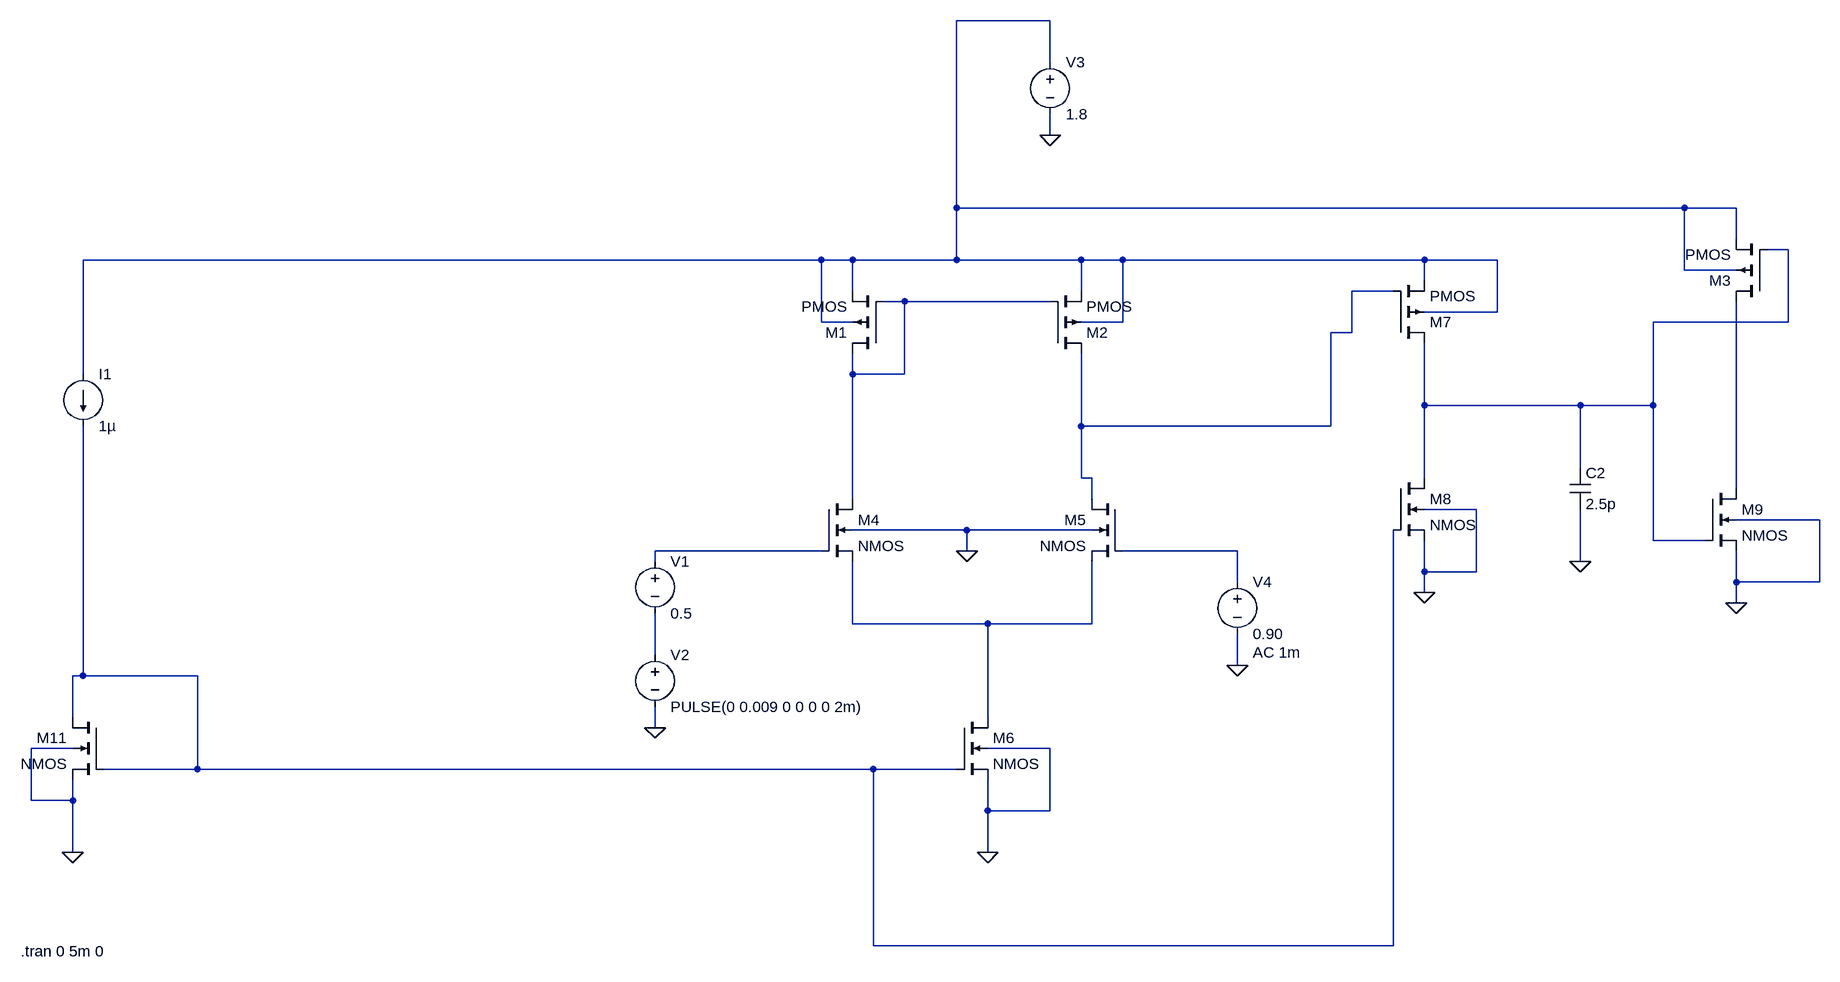
[diagram p0: schematic nmos_input_comparator.asc]
nmos_input_comparator.asc, the LTspice schematic file:
Version 4
SHEET 1 2396 680
WIRE 1088 -768 944 -768
WIRE 1088 -704 1088 -768
WIRE 1088 -592 1088 -624
WIRE 944 -480 944 -768
WIRE 2064 -480 944 -480
WIRE 2144 -480 2064 -480
WIRE 2144 -432 2144 -480
WIRE 2224 -416 2192 -416
WIRE 496 -400 -400 -400
WIRE 736 -400 496 -400
WIRE 784 -400 736 -400
WIRE 944 -400 944 -480
WIRE 944 -400 784 -400
WIRE 1136 -400 944 -400
WIRE 1200 -400 1136 -400
WIRE 1360 -400 1200 -400
WIRE 1664 -400 1360 -400
WIRE 1776 -400 1664 -400
WIRE 2064 -384 2064 -480
WIRE 2144 -384 2064 -384
WIRE 1664 -368 1664 -400
WIRE 784 -352 784 -400
WIRE 1136 -352 1136 -400
WIRE 1616 -352 1552 -352
WIRE 864 -336 832 -336
WIRE 1024 -336 864 -336
WIRE 1088 -336 1024 -336
WIRE 1776 -320 1776 -400
WIRE 1776 -320 1664 -320
WIRE 736 -304 736 -400
WIRE 784 -304 736 -304
WIRE 1200 -304 1200 -400
WIRE 1200 -304 1136 -304
WIRE 2224 -304 2224 -416
WIRE 2224 -304 2016 -304
WIRE 1552 -288 1552 -352
WIRE 1552 -288 1520 -288
WIRE -400 -224 -400 -400
WIRE 784 -224 784 -256
WIRE 864 -224 864 -336
WIRE 864 -224 784 -224
WIRE 2016 -224 2016 -304
WIRE 1664 -208 1664 -272
WIRE 2144 -208 2144 -336
WIRE 1136 -192 1136 -256
WIRE 1664 -176 1664 -208
WIRE 1904 -176 1664 -176
WIRE 2016 -176 2016 -224
WIRE 2016 -176 1904 -176
WIRE 1136 -144 1136 -192
WIRE 1520 -144 1520 -288
WIRE 1520 -144 1136 -144
WIRE 784 -96 784 -224
WIRE 1904 -80 1904 -176
WIRE 1136 -64 1136 -144
WIRE 1152 -64 1136 -64
WIRE 1664 -64 1664 -176
WIRE 2144 -48 2144 -208
WIRE 784 -32 784 -96
WIRE 1152 -32 1152 -64
WIRE 1744 -16 1664 -16
WIRE 2272 0 2144 0
WIRE 960 16 784 16
WIRE 1152 16 960 16
WIRE 2016 32 2016 -176
WIRE 2096 32 2016 32
WIRE 736 48 480 48
WIRE 960 48 960 16
WIRE 1376 48 1200 48
WIRE 480 64 480 48
WIRE 1904 64 1904 -16
WIRE 1664 80 1664 32
WIRE 1744 80 1744 -16
WIRE 1744 80 1664 80
WIRE 1376 96 1376 48
WIRE 2144 96 2144 48
WIRE 2272 96 2272 0
WIRE 2272 96 2144 96
WIRE 1664 112 1664 80
WIRE 2144 128 2144 96
WIRE 784 160 784 64
WIRE 880 160 784 160
WIRE 992 160 880 160
WIRE 1152 160 1152 64
WIRE 1152 160 992 160
WIRE 480 208 480 144
WIRE 1376 224 1376 176
WIRE 1616 224 1616 16
WIRE -400 240 -400 -144
WIRE -400 240 -416 240
WIRE -224 240 -400 240
WIRE -416 304 -416 240
WIRE 992 304 992 160
WIRE 480 320 480 288
WIRE -416 352 -480 352
WIRE 1088 352 992 352
WIRE -224 384 -224 240
WIRE -224 384 -368 384
WIRE 816 384 -224 384
WIRE 944 384 816 384
WIRE -480 432 -480 352
WIRE -416 432 -416 400
WIRE -416 432 -480 432
WIRE 992 448 992 400
WIRE 1088 448 1088 352
WIRE 1088 448 992 448
WIRE -416 512 -416 432
WIRE 992 512 992 448
WIRE 816 656 816 384
WIRE 1616 656 1616 224
WIRE 1616 656 816 656
FLAG 1088 -592 0
FLAG 960 48 0
FLAG 992 512 0
FLAG 1664 112 0
FLAG 1904 64 0
FLAG 2144 128 0
FLAG -416 512 0
FLAG 1376 224 0
FLAG 480 320 0
DATAFLAG 496 -400 ""
DATAFLAG 1360 -400 ""
DATAFLAG 784 -96 ""
DATAFLAG 1136 -192 ""
DATAFLAG 1664 -208 ""
DATAFLAG 2016 -224 ""
DATAFLAG 2144 -208 ""
DATAFLAG 1616 224 ""
DATAFLAG 880 160 ""
DATAFLAG 1024 -336 ""
SYMBOL nmos4 736 -32 R0
SYMATTR InstName M4
SYMATTR Value2 l=1u w=20u
SYMBOL nmos4 1200 -32 M0
SYMATTR InstName M5
SYMATTR Value2 l=1u w=20u
SYMBOL nmos4 944 304 R0
SYMATTR InstName M6
SYMATTR Value2 l=2u w=20u
SYMBOL voltage 1088 -720 R0
WINDOW 123 0 0 Left 2
WINDOW 39 0 0 Left 2
SYMATTR InstName V3
SYMATTR Value 1.8
SYMBOL nmos4 1616 -64 R0
SYMATTR InstName M8
SYMATTR Value2 l=2u w=20u
SYMBOL cap 1888 -80 R0
SYMATTR InstName C2
SYMATTR Value 2.5p
SYMBOL nmos4 2096 -48 R0
SYMATTR InstName M9
SYMATTR Value2 l=1u w=20u
SYMBOL nmos4 -368 304 M0
SYMATTR InstName M11
SYMATTR Value2 l=2u w=20u
SYMBOL current -400 -224 R0
WINDOW 123 0 0 Left 2
WINDOW 39 0 0 Left 2
SYMATTR InstName I1
SYMATTR Value 1µ
SYMBOL voltage 1376 80 R0
WINDOW 123 24 124 Left 2
WINDOW 39 0 0 Left 2
SYMATTR Value2 AC 1m
SYMATTR InstName V4
SYMATTR Value 0.90
SYMBOL voltage 480 48 R0
WINDOW 123 24 124 Left 2
WINDOW 39 0 0 Left 2
SYMATTR InstName V1
SYMATTR Value 0.5
SYMBOL pmos4 832 -256 R180
SYMATTR InstName M1
SYMATTR Value2 l=5u w=20u
SYMBOL pmos4 1088 -256 M180
SYMATTR InstName M2
SYMATTR Value2 l=5u w=20u
SYMBOL pmos4 2192 -336 R180
SYMATTR InstName M3
SYMATTR Value2 l=1u w=20u
SYMBOL pmos4 1616 -272 M180
SYMATTR InstName M7
SYMATTR Value2 l=5u w=20u
SYMBOL voltage 480 192 R0
WINDOW 123 24 124 Left 2
WINDOW 39 0 0 Left 2
SYMATTR InstName V2
SYMATTR Value PULSE(0 0.009 0 0 0 0 2m)
TEXT -496 664 Left 2 !.tran 0 5m 0

The netlist it stands for:
* nmos_input_comparator.asc
M4 N004 N006 N008 0 NMOS l=1u w=20u
M5 N003 N007 N008 0 NMOS l=1u w=20u
M6 N008 N010 0 0 NMOS l=2u w=20u
V3 N001 0 1.8
M8 N002 N010 0 0 NMOS l=2u w=20u
C2 N002 0 2.5p
M9 N005 N002 0 0 NMOS l=1u w=20u
M11 N010 N010 0 0 NMOS l=2u w=20u
I1 N001 N010 1µ
V4 N007 0 0.90 AC 1m
V1 N006 N009 0.5
M1 N004 N004 N001 N001 PMOS l=5u w=20u
M2 N003 N004 N001 N001 PMOS l=5u w=20u
M3 N005 N002 N001 N001 PMOS l=1u w=20u
M7 N002 N003 N001 N001 PMOS l=5u w=20u
V2 N009 0 PULSE(0 0.009 0 0 0 0 2m)
.model NMOS NMOS
.model PMOS PMOS
.lib standard.mos
.tran 0 5m 0
.backanno
.end